# EAGLE design Blinky_Sch (EAGLE 7.3.0)
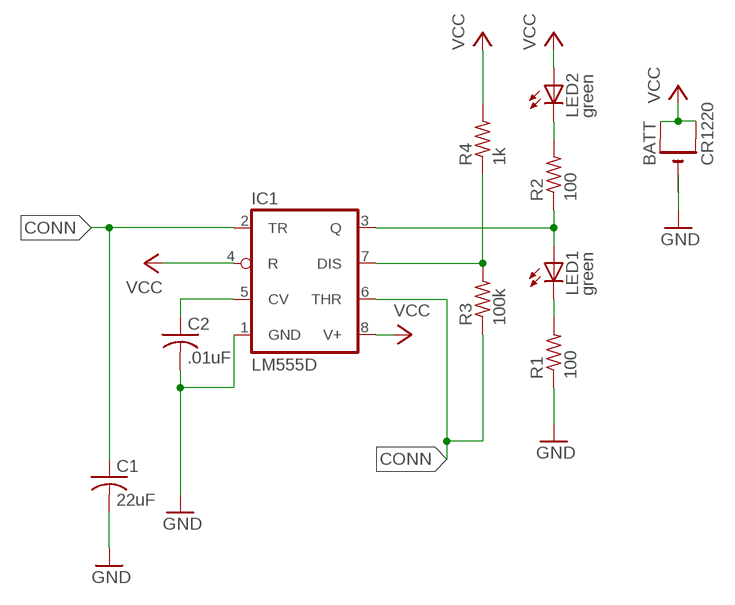
[diagram p0: schematic, sheet 1]

## Parts
BATT  CR1220  CR1220SMT  [CR1220-SMD]
C1  22uF  C-USC0805  [C0805]
C2  .01uF  C-USC0805  [C0805]
IC1  LM555D  [SO08]
LED1  green  LEDCHIPLED_0805  [CHIPLED_0805]
LED2  green  LEDCHIPLED_0805  [CHIPLED_0805]
R1  100  R-US_R0805  [R0805]
R2  100  R-US_R0805  [R0805]
R3  100k  R-US_R0805  [R0805]
R4  1k  R-US_R0805  [R0805]

## Nets
CONN: C1.1 IC1.2(TR) IC1.6(THR) R3.1
GND: C1.2 C2.2 IC1.1(GND) R1.1
N$1: LED2.C R2.2
N$2: IC1.3(Q) LED1.A R2.1
N$3: LED1.C R1.2
N$4: IC1.7(DIS) R3.2 R4.1
N$9: C2.1 IC1.5(CV)
VCC: BATT.+$1(+) BATT.+$2(+1) IC1.4(R) IC1.8(V+) LED2.A R4.2
Unconnected: BATT.-

## Library data of the parts
BATT = adafruit:CR1220: CR1216/CR1220/CR1225 12mm 3V lithium coin cell Great for battery packup. Both SMT and THM holders. Note the THM package has the ground pads on both sides of the PCB so that the masks are the same - this reduces the cost; MF: KEYSTONE; MPN: 3080; OC_FARNELL: 1887942
C1 C2 = adafruit:C-US: CAPACITOR, American symbol; OC_FARNELL: unknown
IC1 = adafruit:*555: TIMER Changed DIP package to have round (not oval) pin pads http://www.ladyada.net/library/pcb/eaglelibrary.html; OC_FARNELL: unknown
LED1 LED2 = adafruit:LED: LED OSRAM: - CHIPLED LG R971, LG N971, LY N971, LG Q971, LY Q971, LO R971, LY R971 LH N974, LH R974 LS Q976, LO Q976, LY Q976 LO Q996 - Hyper CHIPLED LW Q18S LB Q993, LB Q99A, LB R99A - SideLED LS A670, LO A670, LY A670, LG A670, LP A670 LB A673, LV A673, LT A673, LW A673 LH A674 LY A675 LS A676, LA A676, LO A676, LY A676, LW A676 LS A679, LY A679, LG A679 - Hyper Micro SIDELED® LS Y876, LA Y876, LO Y876, LY Y876 LT Y87S - SmartLED LW L88C, LW L88S LB L89C, LB L89S, LG L890 LS L89K, LO L89K, LY L89K LS L896, LA L896, LO L896, LY L896 - TOPLED LS T670, LO T670, LY T670, LG T670, LP T670 LSG T670, LSP T670, LSY T670, LOP T670, LYG T670 LG T671, LOG T671, LSG T671 LB T673, LV T673, LT T673, LW T673 LH T674 LS T676, LA T676, LO T676, LY T676, LB T676, LH T676, LSB T676, LW T676 LB T67C, LV T67C, LT T67C, LS T67K, LO T67K, LY T67K, LW E67C LS E67B, LA E67B, LO E67B, LY E67B, LB E67C, LV E67C, LT E67C LW T67C LS T679, LY T679, LG T679 LS T770, LO T770, LY T770, LG T770, LP T770 LB T773, LV T773, LT T773, LW T773 LH T774 LS E675, LA E675, LY E675, LS T675 LS T776, LA T776, LO T776, LY T776, LB T776 LHGB T686 LT T68C, LB T68C - Hyper Mini TOPLED® LB M676 - Mini TOPLED Santana® LG M470 LS M47K, LO M47K, LY M47K Source: http://www.osram.convergy.de/; OC_FARNELL: unknown
R1-R4 = adafruit:R-US_: RESISTOR, American symbol; OC_FARNELL: unknown

## Net classes
0 default: width 0.305 mm, drill 0.508 mm, clearance 0.254 mm

## Board
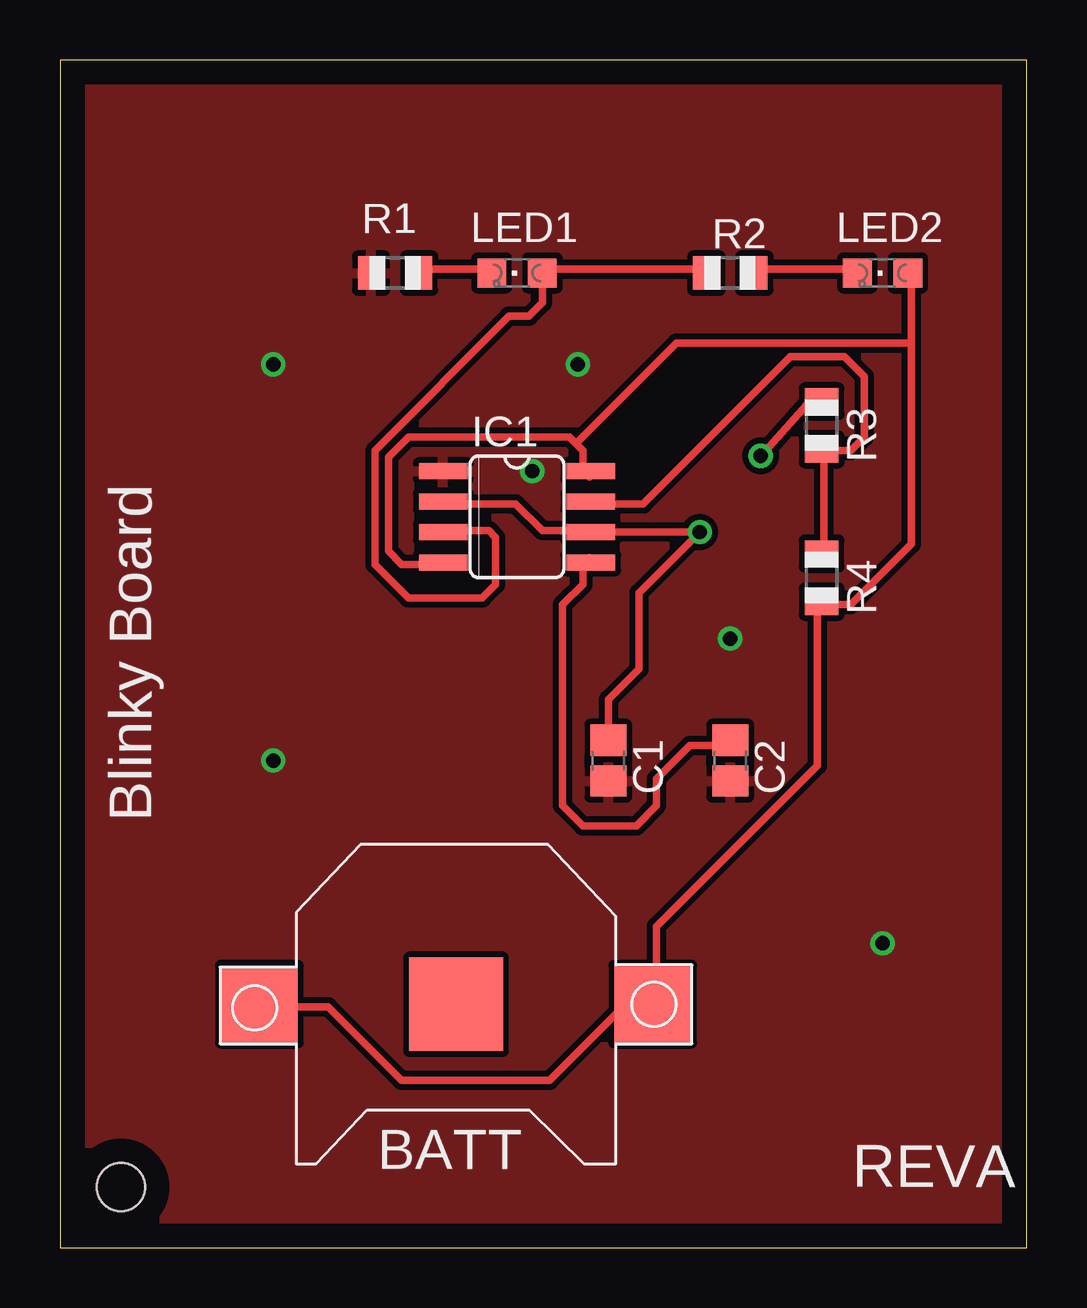
[diagram p1: board, top side]
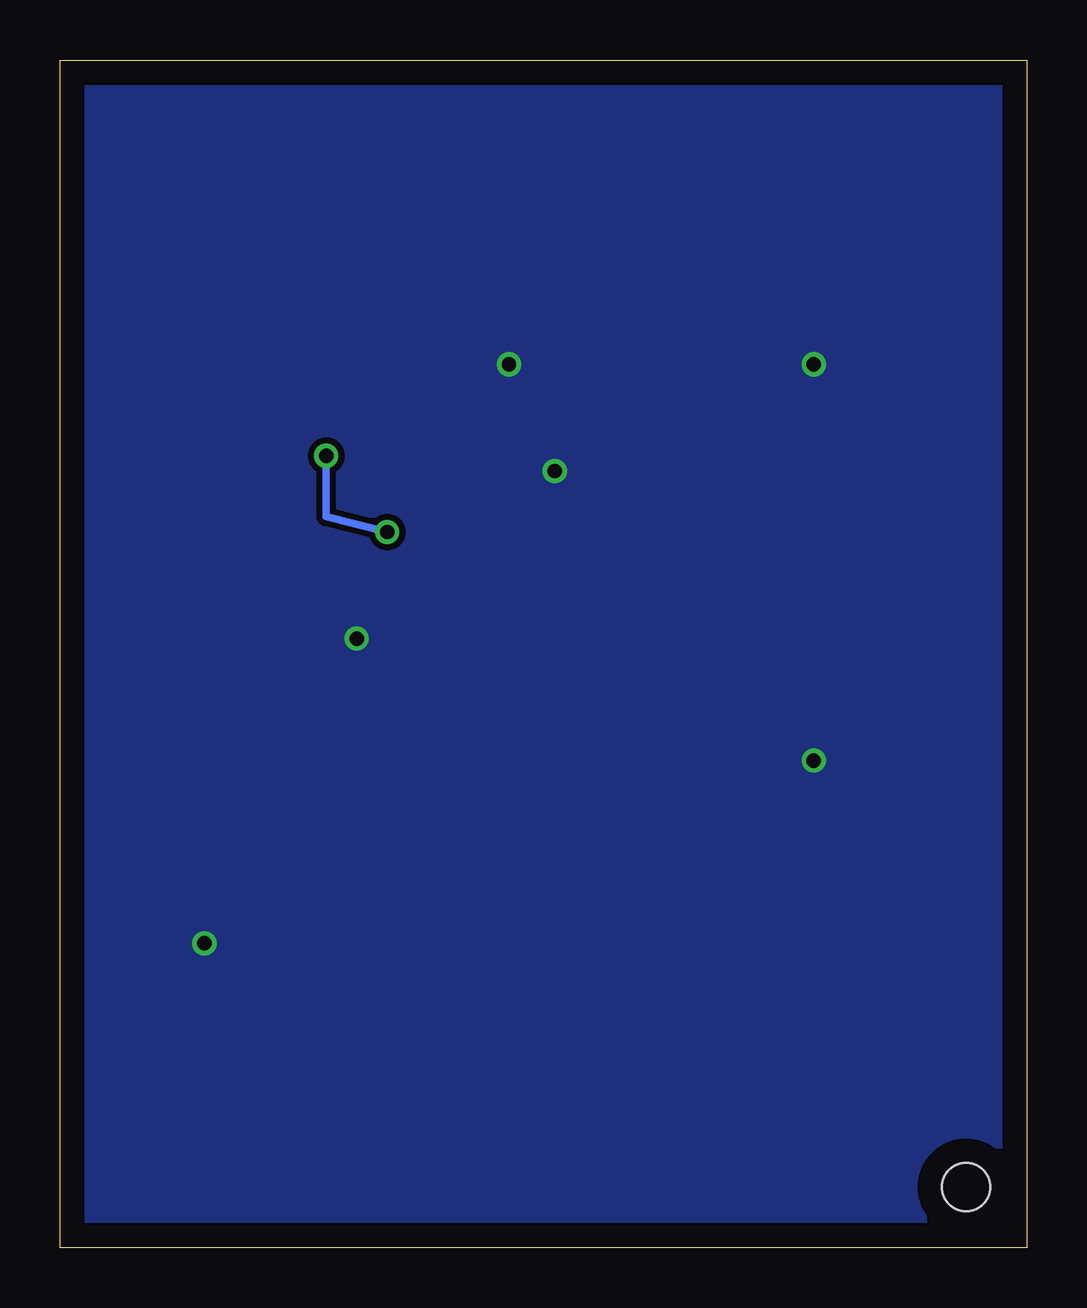
[diagram p2: board, bottom side, seen from below]

Size 40.31 x 49.52 mm. Coordinates in mm from the lower left corner, seen from the top.
Outline: 0,0 40.31,0 40.31,49.52 0,49.52 0,0
Copper layers (1*16): Top 0.035mm / dielectric 1.5mm / Bottom 0.035mm
Design rules "default *": minimum track width 10mil, minimum drill 20mil, track to track 8mil, track to pad 8mil, pad to pad 8mil, via to via 8mil, smd to smd 8mil, copper to edge 40mil, drill to drill 8mil, minimum pad ring 10mil, minimum via ring 8mil, stop-mask expansion 4mil, vias tented up to drill 0mil, thermal gap 10mil
Holes 2 mm at 2.54,2.54

### Footprints (pad centres in the part's own frame; a part is rotated, then mirrored left to right if it is on the bottom)
CR1220-SMD = smd 3.2 x 3.2: +$1 -8.2,0; +$2 8.2,0 | smd 3.9 x 3.9: - 0,0
C0805 = smd 1.3 x 1.5: 1 -0.85,0; 2 0.85,0
SO08 = smd 0.66 x 2.032: 1 -1.905,-3.073; 2 -0.635,-3.073; 3 0.635,-3.073; 4 1.905,-3.073; 5 1.905,3.073; 6 0.635,3.073; 7 -0.635,3.073; 8 -1.905,3.073
CHIPLED_0805 = smd 1.2 x 1.2: A 0,-1.05; C 0,1.05
R0805 = smd 1.1 x 1.4: 1 -1,0; 2 1,0

### Placement (x,y rotation side)
BATT  16.51,10.16 180 top
C1  22.86,20.32 270 top
C2  27.94,20.32 270 top
IC1  19.05,30.48 270 top
LED1  19.05,40.64 90 top
LED2  34.29,40.64 90 top
R1  13.97,40.64 0 top
R2  27.94,40.64 0 top
R3  31.75,34.29 270 top
R4  31.75,27.94 270 top

### Tracks (layer width: path | path; a pad name or v marks a point on that pad's centre or on a via)
CONN  (via drill 0.6)
  Top 0.305: IC1.2 16.2,31.01 19,31.01 20.12,29.9 22.07,29.9 IC1.6 v26.67,29.84 24.13,27.3 24.13,24.13 22.86,22.86 C1.1 | v29.21,33.02 31.48,35.56 R3.1
  Bottom 0.305: v26.67,29.84 29.21,30.48 v29.21,33.02
GND  (via drill 0.6)
  other vias: 8.89,36.83 21.59,36.83 19.68,32.38 8.89,20.32 27.94,25.4 34.29,12.7
  pour Top: -1.27,50.8 -1.27,-1.27 41.91,-1.27 41.91,50.8
  pour Bottom: -1.27,50.8 -1.27,-1.27 41.91,-1.27 41.91,50.8
N$1
  Top 0.305: LED2.C 32.97,40.79 29.06,40.79 R2.2
N$2
  Top 0.305: R2.1 26.82,40.79 20.12,40.79 LED1.A 20.12,40.51 20.12,39.4 19.56,38.84 18.72,38.84 13.13,33.25 13.13,28.5 14.53,27.1 17.6,27.1 18.16,27.66 18.16,29.62 17.88,29.9 16.2,29.9 IC1.3
N$3
  Top 0.305: LED1.C 17.88,40.79 15.09,40.79 R1.2
N$4
  Top 0.305: 31.85,33.25 31.85,29.06 R4.1 | 31.85,33.25 32.97,33.25 33.53,33.81 33.53,36.32 32.69,37.16 30.45,37.16 24.31,31.01 22.35,31.01 IC1.7 | 31.85,33.25 R3.2
N$9
  Top 0.305: C2.1 27.94,20.95 26.26,20.95 24.87,19.56 24.87,18.44 24.03,17.6 21.79,17.6 20.95,18.44 20.95,26.82 21.79,27.66 21.79,28.5 22.07,28.78 IC1.5
VCC
  Top 0.305: BATT.+$2 8.38,10.06 11.18,10.06 14.25,6.99 20.4,6.99 23.47,10.06 24.59,10.06 BATT.+$1 24.87,10.34 24.87,13.41 31.57,20.12 31.57,26.82 R4.2 31.85,26.82 32.97,26.82 35.48,29.34 35.48,37.72 | 21.51,33.53 21.79,33.25 21.79,32.41 22.07,32.13 IC1.8 | 21.51,33.53 21.23,33.81 14.53,33.81 13.69,32.97 13.69,29.06 14.25,28.5 15.93,28.5 IC1.4 | 35.48,37.72 35.48,40.51 LED2.A | 21.51,33.53 25.7,37.72 35.48,37.72

### Text on the board
tPlace: Blinky Board | REVA